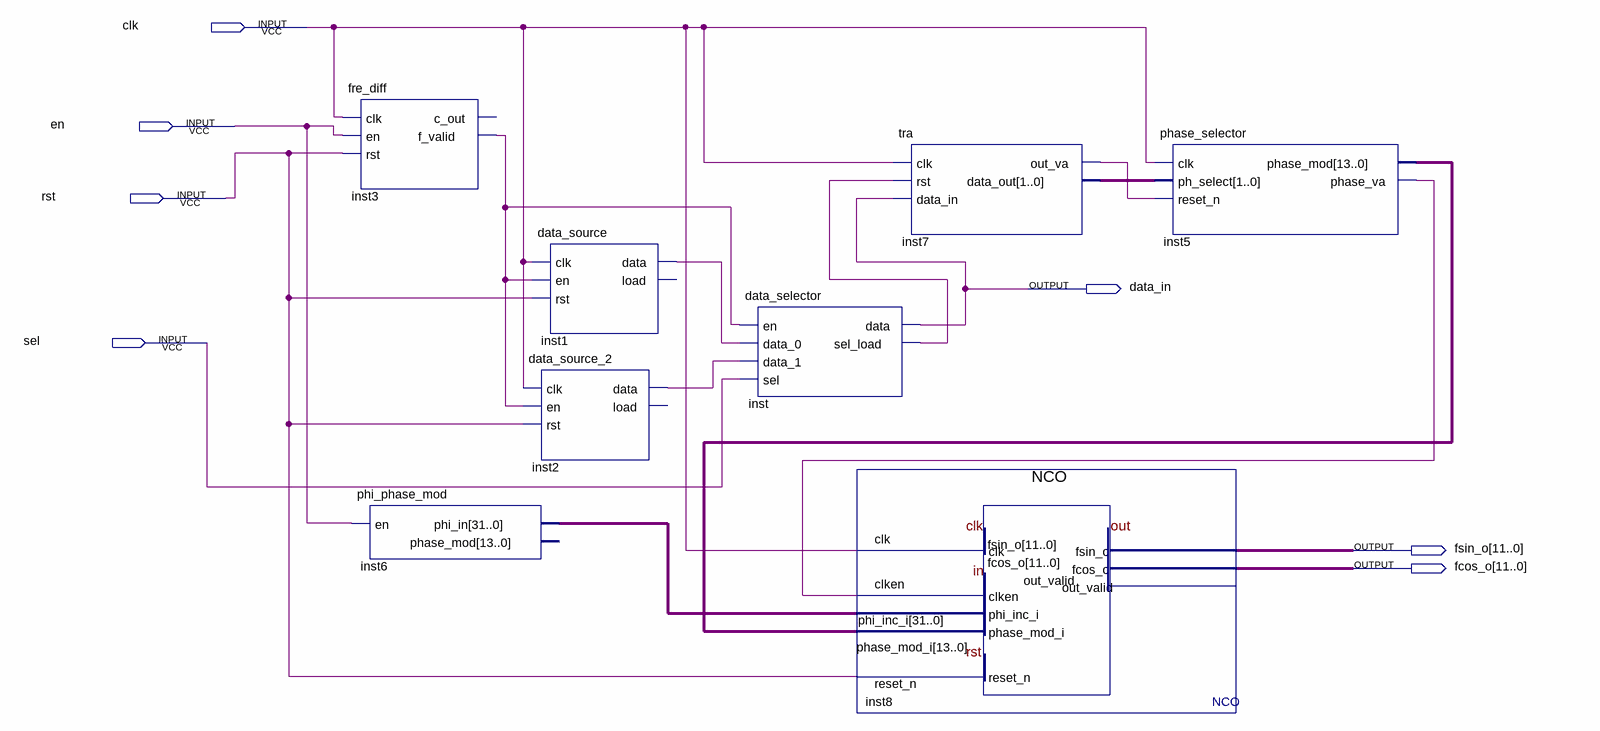
[diagram p0: schematic sheet]
// Quartus schematic QPSK.bdf as structural Verilog: 8 symbols, 7 pins
module QPSK (
  input  clk,
  input  en,
  input  rst,
  input  sel,
  output data_in,
  output [11:0] fsin_o,
  output [11:0] fcos_o
);

  wire inst1_data, inst2_data, inst3_f_valid, inst5_phase_va, inst7_out_va, inst_sel_load;
  wire [1:0] inst7_data_out;
  wire [13:0] inst5_phase_mod;
  wire [31:0] inst6_phi_in;

  fre_diff inst3 (.clk(clk), .en(en), .rst(rst), .f_valid(inst3_f_valid));  // open: c_out
  phi_phase_mod inst6 (.en(en), .phi_in(inst6_phi_in));  // open: phase_mod
  data_source inst1 (.clk(clk), .en(inst3_f_valid), .rst(rst), .data(inst1_data));  // open: load
  data_source_2 inst2 (.clk(clk), .en(inst3_f_valid), .rst(rst), .data(inst2_data));  // open: load
  data_selector inst (
    .en(inst3_f_valid), .data_0(inst1_data), .data_1(inst2_data), .sel(sel), .data(data_in),
    .sel_load(inst_sel_load));
  NCO inst8 (
    .clk(clk), .clken(inst5_phase_va), .phi_inc_i(inst6_phi_in), .phase_mod_i(inst5_phase_mod),
    .reset_n(rst), .fsin_o(fsin_o), .fcos_o(fcos_o));  // open: out_valid
  tra inst7 (.clk(clk), .rst(inst_sel_load), .data_in(data_in), .out_va(inst7_out_va), .data_out(inst7_data_out));
  phase_selector inst5 (
    .clk(clk), .ph_select(inst7_data_out), .reset_n(inst7_out_va), .phase_mod(inst5_phase_mod),
    .phase_va(inst5_phase_va));
endmodule
